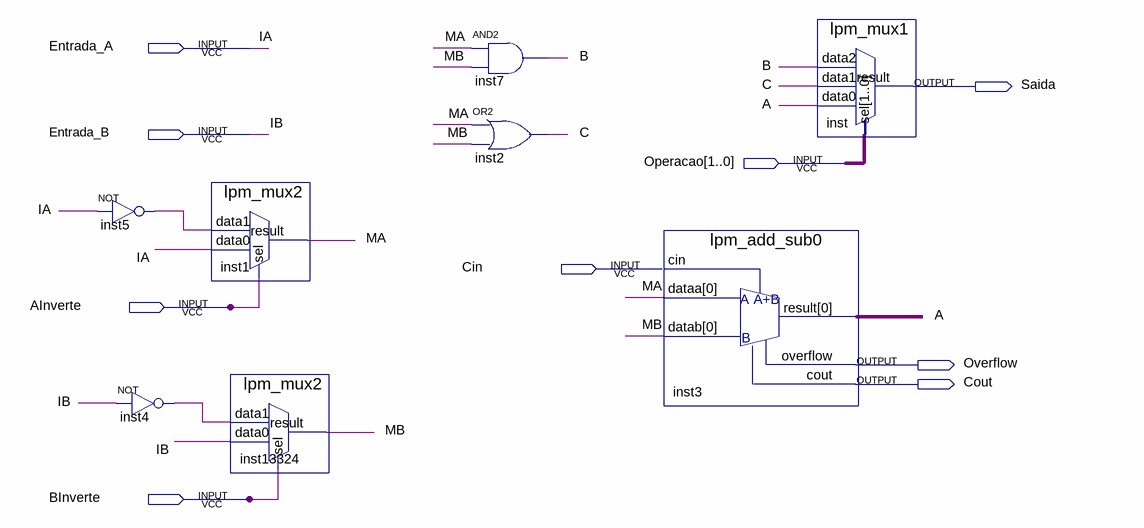
[diagram p0: schematic sheet]
// Quartus schematic ULA.bdf as structural Verilog: 8 symbols, 9 pins
module ULA (
  input  Entrada_A,
  input  Entrada_B,
  input  [1:0] Operacao,
  input  Cin,
  input  AInverte,
  input  BInverte,
  output Saida,
  output Overflow,
  output Cout
);

  wire A, B, C, inst4_out, inst5_out, MA, MB;

  not inst5 (inst5_out, Entrada_A);
  not inst4 (inst4_out, Entrada_B);
  lpm_mux2 inst1 (.data1(inst5_out), .data0(Entrada_A), .sel(AInverte), .result(MA));
  lpm_mux2 inst13324 (.data1(inst4_out), .data0(Entrada_B), .sel(BInverte), .result(MB));
  and inst7 (B, MA, MB);
  or inst2 (C, MA, MB);
  lpm_add_sub0 inst3 (.dataa(MA), .datab(MB), .result(A), .overflow(Overflow), .cout(Cout));  // open: cin
  lpm_mux1 inst (.data2(B), .data1(C), .data0(A), .result(Saida));  // open: sel

  // Other names for the same wires on the sheet: IA = Entrada_A; IB = Entrada_B
endmodule
